# Altium project BBB DB25 CNC Cape.PrjPcb
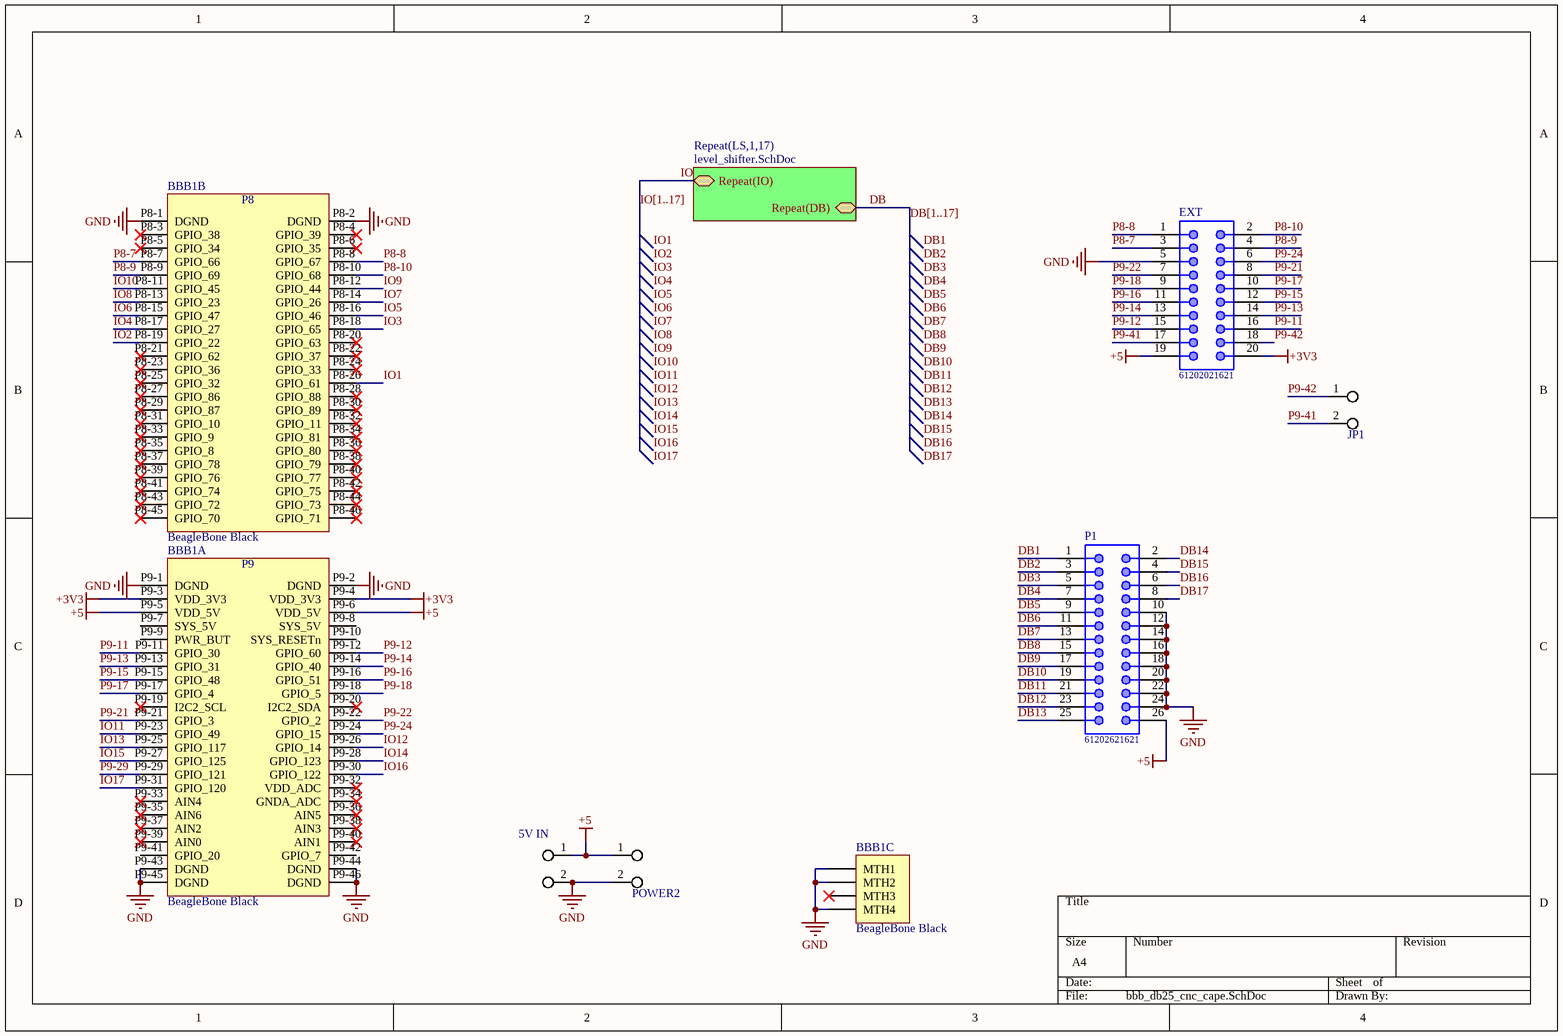
[diagram p0: bbb_db25_cnc_cape.SchDoc]
2 sheets, 91 parts. Net scope: hierarchical (ports join the sheet entries above them; power ports are global).
Sheets:
  bbb_db25_cnc_cape.SchDoc
    LS1 = level_shifter.SchDoc
    LS2 = level_shifter.SchDoc
    LS3 = level_shifter.SchDoc
    LS4 = level_shifter.SchDoc
    LS5 = level_shifter.SchDoc
    LS6 = level_shifter.SchDoc
    LS7 = level_shifter.SchDoc
    LS8 = level_shifter.SchDoc
    LS9 = level_shifter.SchDoc
    LS10 = level_shifter.SchDoc
    LS11 = level_shifter.SchDoc
    LS12 = level_shifter.SchDoc
    LS13 = level_shifter.SchDoc
    LS14 = level_shifter.SchDoc
    LS15 = level_shifter.SchDoc
    LS16 = level_shifter.SchDoc
    LS17 = level_shifter.SchDoc

## Sheet bbb_db25_cnc_cape.SchDoc
size A4

### Parts
5V_IN  Header 1x2  [Screw Terminal 1x2 5.08mm Vertical]  (value not drawn)
BBB1  BeagleBone Black  [BeagleBone_Black_Cape]  (parts A,B,C of 3)
EXT  61202021621  [61202021621]
JP1  Header 1x2  [Header 1x2 100mil Vertical]  (value not drawn)
P1  61202621621  [61202621621]
POWER2  Header 1x2  [Screw Terminal 1x2 3.5mm Vertical]  (value not drawn)

### Sub-sheets
Repeat(LS,1,17) = level_shifter.SchDoc: Repeat(IO) (bidir), Repeat(DB) (bidir)

### Nets
+3V3: BBB1.P9-3(VDD_3V3) BBB1.P9-4(VDD_3V3) EXT.20
+5: 5V_IN.1 BBB1.P9-5(VDD_5V) BBB1.P9-6(VDD_5V) EXT.19 P1.26 POWER2.1
GND: 5V_IN.2 BBB1.MTH1 BBB1.MTH2 BBB1.MTH4 BBB1.P8-1(DGND) BBB1.P8-2(DGND) BBB1.P9-1(DGND) BBB1.P9-2(DGND) BBB1.P9-43(DGND) BBB1.P9-44(DGND) BBB1.P9-45(DGND) BBB1.P9-46(DGND) EXT.5 P1.10 P1.12 P1.14 P1.16 P1.18 P1.20 P1.22 P1.24 POWER2.2
DB: sheet Repeat(LS,1,17)/Repeat(DB)
DB1: P1.1
DB2: P1.3
DB3: P1.5
DB4: P1.7
DB5: P1.9
DB6: P1.11
DB7: P1.13
DB8: P1.15
DB9: P1.17
DB10: P1.19
DB11: P1.21
DB12: P1.23
DB13: P1.25
DB14: P1.2
DB15: P1.4
DB16: P1.6
DB17: P1.8
IO: sheet Repeat(LS,1,17)/Repeat(IO)
IO1: BBB1.P8-26(GPIO_61)
IO2: BBB1.P8-19(GPIO_22)
IO3: BBB1.P8-18(GPIO_65)
IO4: BBB1.P8-17(GPIO_27)
IO5: BBB1.P8-16(GPIO_46)
IO6: BBB1.P8-15(GPIO_47)
IO7: BBB1.P8-14(GPIO_26)
IO8: BBB1.P8-13(GPIO_23)
IO9: BBB1.P8-12(GPIO_44)
IO10: BBB1.P8-11(GPIO_45)
IO11: BBB1.P9-23(GPIO_49)
IO12: BBB1.P9-26(GPIO_14)
IO13: BBB1.P9-25(GPIO_117)
IO14: BBB1.P9-28(GPIO_123)
IO15: BBB1.P9-27(GPIO_125)
IO16: BBB1.P9-30(GPIO_122)
IO17: BBB1.P9-31(GPIO_120)
P8-7: BBB1.P8-7(GPIO_66) EXT.3
P8-8: BBB1.P8-8(GPIO_67) EXT.1
P8-9: BBB1.P8-9(GPIO_69) EXT.4
P8-10: BBB1.P8-10(GPIO_68) EXT.2
P9-11: BBB1.P9-11(GPIO_30) EXT.16
P9-12: BBB1.P9-12(GPIO_60) EXT.15
P9-13: BBB1.P9-13(GPIO_31) EXT.14
P9-14: BBB1.P9-14(GPIO_40) EXT.13
P9-15: BBB1.P9-15(GPIO_48) EXT.12
P9-16: BBB1.P9-16(GPIO_51) EXT.11
P9-17: BBB1.P9-17(GPIO_4) EXT.10
P9-18: BBB1.P9-18(GPIO_5) EXT.9
P9-21: BBB1.P9-21(GPIO_3) EXT.8
P9-22: BBB1.P9-22(GPIO_2) EXT.7
P9-24: BBB1.P9-24(GPIO_15) EXT.6
P9-29: BBB1.P9-29(GPIO_121)
P9-41: EXT.17 JP1.2
P9-42: EXT.18 JP1.1

Not connected (* = marked no-connect by the designer): BBB1 MTH3* P8-3(GPIO_38)* P8-4(GPIO_39)* P8-5(GPIO_34)* P8-6(GPIO_35)* P8-20(GPIO_63)* P8-21(GPIO_62)* P8-22(GPIO_37)* P8-23(GPIO_36)* P8-24(GPIO_33)* P8-25(GPIO_32)* P8-27(GPIO_86)* P8-28(GPIO_88)* P8-29(GPIO_87)* P8-30(GPIO_89)* P8-31(GPIO_10)* P8-32(GPIO_11)* P8-33(GPIO_9)* P8-34(GPIO_81)* P8-35(GPIO_8)* P8-36(GPIO_80)* P8-37(GPIO_78)* P8-38(GPIO_79)* P8-39(GPIO_76)* P8-40(GPIO_77)* P8-41(GPIO_74)* P8-42(GPIO_75)* P8-43(GPIO_72)* P8-44(GPIO_73)* P8-45(GPIO_70)* P8-46(GPIO_71)* P9-7(SYS_5V) P9-8(SYS_5V) P9-9(PWR_BUT) P9-10(SYS_RESETn) P9-19(I2C2_SCL)* P9-20(I2C2_SDA)* P9-32(VDD_ADC)* P9-33(AIN4)* P9-34(GNDA_ADC)* P9-35(AIN6)* P9-36(AIN5)* P9-37(AIN2)* P9-38(AIN3)* P9-39(AIN0)* P9-40(AIN1)* P9-41(GPIO_20) P9-42(GPIO_7)

### Buses and harness runs
bus DB[1..17]
bus IO[1..17]

### Notes on the sheet
- Labels drawn without touching a wire or pin: DB1, DB2, DB3, DB4, DB5, DB6, DB7, DB8, DB9, DB10, DB11, DB12, DB13, DB14, DB15, DB16, DB17, IO1, IO2, IO3, IO4, IO5, IO6, IO7, IO8, IO9, IO10, IO11, IO12, IO13, IO14, IO15, IO16, IO17
- (in symbol BeagleBone Black, part A) P9
- (in symbol BeagleBone Black, part B) P8

### Library data of the parts
5V_IN JP1 POWER2 = Header 1x2: Standard Header Connector
EXT = 61202021621: Male Box Header WR-BHD, THT, Vertical, pitch 2.54 mm, 20 pins; Pitch: 2.54 mm; Working Voltage: 250 VAC; Withstanding Voltage: 500 VAC; Contact Resistance: 20 mOhm; Pin Number: 20; ComponentLink1Description: Manufacturer; ComponentLink1URL: http://www.we-online.de; ComponentLink2Description: Datasheet; ComponentLink2URL: https://katalog.we-online.de/em/datasheet/6120xx21621.pdf; Part Number: 61202021621; Published Date: August 2018; Publisher: Wurth Elektronik; Operating Temperature: -40 to 125 degC; Packaging: Tray; Gender: Male; Mounting Technology: THT; Orientation: Vertical
P1 = 61202621621: Male Box Header WR-BHD, THT, Vertical, pitch 2.54 mm, 26 pins; Pitch: 2.54 mm; Working Voltage: 250 VAC; Withstanding Voltage: 500 VAC; Contact Resistance: 20 mOhm; Pin Number: 26; ComponentLink1Description: Manufacturer; ComponentLink1URL: http://www.we-online.de; ComponentLink2Description: Datasheet; ComponentLink2URL: https://katalog.we-online.de/em/datasheet/6120xx21621.pdf; Part Number: 61202621621; Published Date: August 2018; Publisher: Wurth Elektronik; Operating Temperature: -40 to 125 degC; Packaging: Tray; Gender: Male; Mounting Technology: THT; Orientation: Vertical

## Sheet level_shifter.SchDoc
size A4
Used 17 times, as channels LS1, LS2, LS3, LS4, LS5, LS6, LS7, LS8, LS9, LS10, LS11, LS12, LS13, LS14, LS15, LS16, LS17. Parts and nets are listed once, with the designators drawn on the sheet.
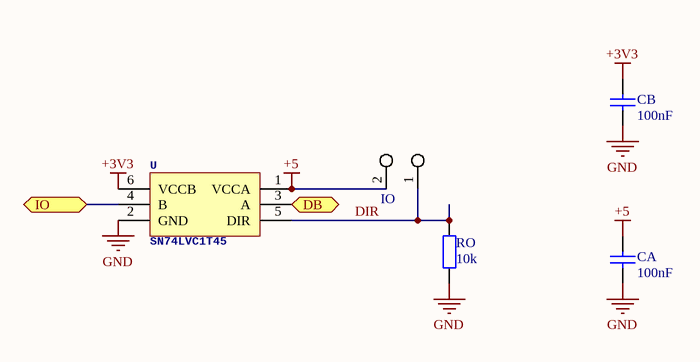
[diagram p1: level_shifter.SchDoc]

### Parts
CA  value 100nF  [CAP 0402/1005 RF]  (hidden comment: Capacitor)
CB  value 100nF  [CAP 0402/1005 RF]  (hidden comment: Capacitor)
IO  Header 1x2  [Header 1x2 100mil Vertical]  (value not drawn)
RO  value 10k  [RES 0402/1005 RF]  (hidden comment: Resistor)
U  SN74LVC1T45  [SOT65P210X110-6N]

### Ports
DB, IO

### Nets
+3V3: CB.2 U.6(VCCB)
+5: CA.2 IO.2 U.1(VCCA)
GND: CA.1 CB.1 RO.2 U.2(GND)
DB: U.3(A) ; port DB
DIR: IO.1 RO.1 U.5(DIR)
IO: U.4(B) ; port IO

### Channels
LS1: designators end in 1; ports DB=DB1 IO=IO1
LS2: designators end in 2; ports DB=DB2 IO=IO2
LS3: designators end in 3; ports DB=DB3 IO=IO3
LS4: designators end in 4; ports DB=DB4 IO=IO4
LS5: designators end in 5; ports DB=DB5 IO=IO5
LS6: designators end in 6; ports DB=DB6 IO=IO6
LS7: designators end in 7; ports DB=DB7 IO=IO7
LS8: designators end in 8; ports DB=DB8 IO=IO8
LS9: designators end in 9; ports DB=DB9 IO=IO9
LS10: designators end in 10; ports DB=DB10 IO=IO10
LS11: designators end in 11; ports DB=DB11 IO=IO11
LS12: designators end in 12; ports DB=DB12 IO=IO12
LS13: designators end in 13; ports DB=DB13 IO=IO13
LS14: designators end in 14; ports DB=DB14 IO=IO14
LS15: designators end in 15; ports DB=DB15 IO=IO15
LS16: designators end in 16; ports DB=DB16 IO=IO16
LS17: designators end in 17; ports DB=DB17 IO=IO17

### Library data of the parts
CA CB = Capacitor: Capacitor Non-Polarized Generic; Rating: *
IO = Header 1x2: Standard Header Connector
RO = Resistor: Resistor EU Generic
U = SN74LVC1T45: Level Shifter with DIR, Single-Bit, Dual-Supply, Automotive; Mfr: Texas Instruments; Mfr_PN: SN74LVC1T45DCKR; Height: 1.1mm; LCSC: C9382

## Nets that join several sheets
+3V3: bbb_db25_cnc_cape (BBB1.P9-3 BBB1.P9-4 EXT.20), LS1 (CB1.2 U1.6), LS2 (CB2.2 U2.6), LS3 (CB3.2 U3.6), LS4 (CB4.2 U4.6), LS5 (CB5.2 U5.6), LS6 (CB6.2 U6.6), LS7 (CB7.2 U7.6), LS8 (CB8.2 U8.6), LS9 (CB9.2 U9.6), LS10 (CB10.2 U10.6), LS11 (CB11.2 U11.6), LS12 (CB12.2 U12.6), LS13 (CB13.2 U13.6), LS14 (CB14.2 U14.6), LS15 (CB15.2 U15.6), LS16 (CB16.2 U16.6), LS17 (CB17.2 U17.6)
+5: bbb_db25_cnc_cape (6 pins), LS1 (CA1.2 IO1.2 U1.1), LS2 (CA2.2 IO2.2 U2.1), LS3 (CA3.2 IO3.2 U3.1), LS4 (CA4.2 IO4.2 U4.1), LS5 (CA5.2 IO5.2 U5.1), LS6 (CA6.2 IO6.2 U6.1), LS7 (CA7.2 IO7.2 U7.1), LS8 (CA8.2 IO8.2 U8.1), LS9 (CA9.2 IO9.2 U9.1), LS10 (CA10.2 IO10.2 U10.1), LS11 (CA11.2 IO11.2 U11.1), LS12 (CA12.2 IO12.2 U12.1), LS13 (CA13.2 IO13.2 U13.1), LS14 (CA14.2 IO14.2 U14.1), LS15 (CA15.2 IO15.2 U15.1), LS16 (CA16.2 IO16.2 U16.1), LS17 (CA17.2 IO17.2 U17.1)
GND: bbb_db25_cnc_cape (22 pins), LS1 (CA1.1 CB1.1 RO1.2 U1.2), LS2 (CA2.1 CB2.1 RO2.2 U2.2), LS3 (CA3.1 CB3.1 RO3.2 U3.2), LS4 (CA4.1 CB4.1 RO4.2 U4.2), LS5 (CA5.1 CB5.1 RO5.2 U5.2), LS6 (CA6.1 CB6.1 RO6.2 U6.2), LS7 (CA7.1 CB7.1 RO7.2 U7.2), LS8 (CA8.1 CB8.1 RO8.2 U8.2), LS9 (CA9.1 CB9.1 RO9.2 U9.2), LS10 (CA10.1 CB10.1 RO10.2 U10.2), LS11 (CA11.1 CB11.1 RO11.2 U11.2), LS12 (CA12.1 CB12.1 RO12.2 U12.2), LS13 (CA13.1 CB13.1 RO13.2 U13.2), LS14 (CA14.1 CB14.1 RO14.2 U14.2), LS15 (CA15.1 CB15.1 RO15.2 U15.2), LS16 (CA16.1 CB16.1 RO16.2 U16.2), LS17 (CA17.1 CB17.1 RO17.2 U17.2)
DB1: bbb_db25_cnc_cape (P1.1), LS1 (U1.3)
DB2: bbb_db25_cnc_cape (P1.3), LS2 (U2.3)
DB3: bbb_db25_cnc_cape (P1.5), LS3 (U3.3)
DB4: bbb_db25_cnc_cape (P1.7), LS4 (U4.3)
DB5: bbb_db25_cnc_cape (P1.9), LS5 (U5.3)
DB6: bbb_db25_cnc_cape (P1.11), LS6 (U6.3)
DB7: bbb_db25_cnc_cape (P1.13), LS7 (U7.3)
DB8: bbb_db25_cnc_cape (P1.15), LS8 (U8.3)
DB9: bbb_db25_cnc_cape (P1.17), LS9 (U9.3)
DB10: bbb_db25_cnc_cape (P1.19), LS10 (U10.3)
DB11: bbb_db25_cnc_cape (P1.21), LS11 (U11.3)
DB12: bbb_db25_cnc_cape (P1.23), LS12 (U12.3)
DB13: bbb_db25_cnc_cape (P1.25), LS13 (U13.3)
DB14: bbb_db25_cnc_cape (P1.2), LS14 (U14.3)
DB15: bbb_db25_cnc_cape (P1.4), LS15 (U15.3)
DB16: bbb_db25_cnc_cape (P1.6), LS16 (U16.3)
DB17: bbb_db25_cnc_cape (P1.8), LS17 (U17.3)
IO1: bbb_db25_cnc_cape (BBB1.P8-26), LS1 (U1.4)
IO2: bbb_db25_cnc_cape (BBB1.P8-19), LS2 (U2.4)
IO3: bbb_db25_cnc_cape (BBB1.P8-18), LS3 (U3.4)
IO4: bbb_db25_cnc_cape (BBB1.P8-17), LS4 (U4.4)
IO5: bbb_db25_cnc_cape (BBB1.P8-16), LS5 (U5.4)
IO6: bbb_db25_cnc_cape (BBB1.P8-15), LS6 (U6.4)
IO7: bbb_db25_cnc_cape (BBB1.P8-14), LS7 (U7.4)
IO8: bbb_db25_cnc_cape (BBB1.P8-13), LS8 (U8.4)
IO9: bbb_db25_cnc_cape (BBB1.P8-12), LS9 (U9.4)
IO10: bbb_db25_cnc_cape (BBB1.P8-11), LS10 (U10.4)
IO11: bbb_db25_cnc_cape (BBB1.P9-23), LS11 (U11.4)
IO12: bbb_db25_cnc_cape (BBB1.P9-26), LS12 (U12.4)
IO13: bbb_db25_cnc_cape (BBB1.P9-25), LS13 (U13.4)
IO14: bbb_db25_cnc_cape (BBB1.P9-28), LS14 (U14.4)
IO15: bbb_db25_cnc_cape (BBB1.P9-27), LS15 (U15.4)
IO16: bbb_db25_cnc_cape (BBB1.P9-30), LS16 (U16.4)
IO17: bbb_db25_cnc_cape (BBB1.P9-31), LS17 (U17.4)